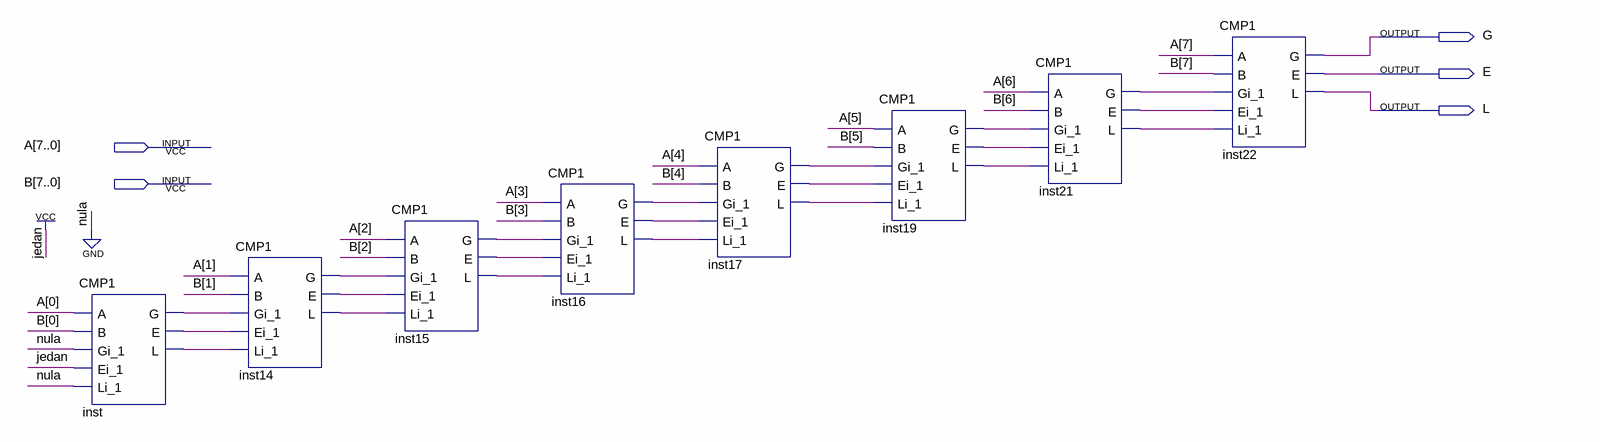
[diagram p0: schematic sheet]
// Quartus schematic CMP8.bdf as structural Verilog: 8 symbols, 5 pins
module CMP8 (
  input  [7:0] A,
  input  [7:0] B,
  output G,
  output E,
  output L
);

  wire inst14_e, inst14_g, inst14_l, inst15_e, inst15_g, inst15_l, inst16_e, inst16_g, inst16_l, inst17_e,
       inst17_g, inst17_l, inst19_e, inst19_g, inst19_l, inst21_e, inst21_g, inst21_l, inst_e, inst_g, inst_l;

  CMP1 inst (.A(A[0]), .B(B[0]), .Gi_1(1'b0), .Ei_1(1'b1), .Li_1(1'b0), .G(inst_g), .E(inst_e), .L(inst_l));
  CMP1 inst14 (
    .A(A[1]), .B(B[1]), .Gi_1(inst_g), .Ei_1(inst_e), .Li_1(inst_l), .G(inst14_g), .E(inst14_e), .L(inst14_l));
  CMP1 inst15 (
    .A(A[2]), .B(B[2]), .Gi_1(inst14_g), .Ei_1(inst14_e), .Li_1(inst14_l), .G(inst15_g), .E(inst15_e),
    .L(inst15_l));
  CMP1 inst16 (
    .A(A[3]), .B(B[3]), .Gi_1(inst15_g), .Ei_1(inst15_e), .Li_1(inst15_l), .G(inst16_g), .E(inst16_e),
    .L(inst16_l));
  CMP1 inst17 (
    .A(A[4]), .B(B[4]), .Gi_1(inst16_g), .Ei_1(inst16_e), .Li_1(inst16_l), .G(inst17_g), .E(inst17_e),
    .L(inst17_l));
  CMP1 inst19 (
    .A(A[5]), .B(B[5]), .Gi_1(inst17_g), .Ei_1(inst17_e), .Li_1(inst17_l), .G(inst19_g), .E(inst19_e),
    .L(inst19_l));
  CMP1 inst21 (
    .A(A[6]), .B(B[6]), .Gi_1(inst19_g), .Ei_1(inst19_e), .Li_1(inst19_l), .G(inst21_g), .E(inst21_e),
    .L(inst21_l));
  CMP1 inst22 (.A(A[7]), .B(B[7]), .Gi_1(inst21_g), .Ei_1(inst21_e), .Li_1(inst21_l), .G(G), .E(E), .L(L));
endmodule
